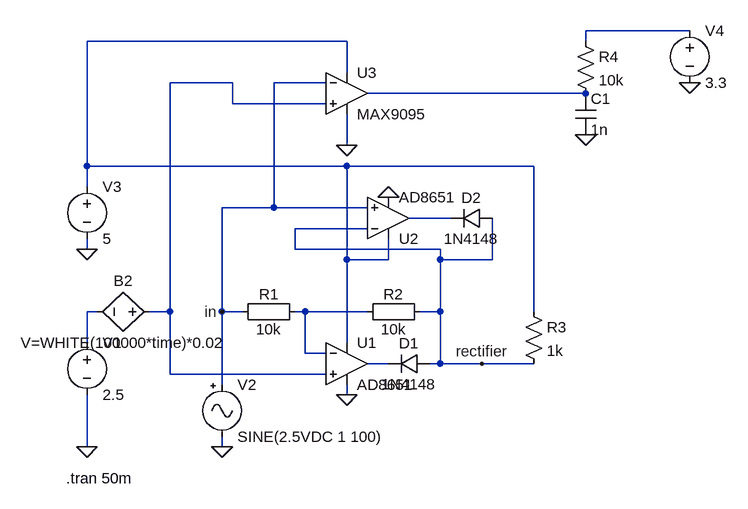
[diagram p0: schematic Precision rectifier 12V supply 2V5 to 5V to 0V to 5V.asc]
Precision rectifier 12V supply 2V5 to 5V to 0V to 5V.asc, the LTspice schematic file:
Version 4
SHEET 1 1444 680
WIRE 896 -320 736 -320
WIRE 368 -304 -32 -304
WIRE 736 -304 736 -320
WIRE 368 -256 368 -304
WIRE 192 -240 96 -240
WIRE 336 -240 256 -240
WIRE 736 -224 400 -224
WIRE 192 -208 192 -240
WIRE 336 -208 192 -208
WIRE 368 -144 368 -192
WIRE -32 -112 -32 -304
WIRE 368 -112 -32 -112
WIRE 656 -112 368 -112
WIRE -32 -80 -32 -112
WIRE 256 -48 256 -240
WIRE 256 -48 176 -48
WIRE 400 -48 256 -48
WIRE 528 -32 464 -32
WIRE 400 -16 288 -16
WIRE -32 16 -32 0
WIRE 288 16 288 -16
WIRE 512 16 288 16
WIRE 368 32 368 -112
WIRE 432 32 432 0
WIRE 432 32 368 32
WIRE 512 32 512 16
WIRE 592 32 592 -32
WIRE 592 32 512 32
WIRE -16 112 -32 112
WIRE 96 112 96 -240
WIRE 96 112 64 112
WIRE 176 112 176 -48
WIRE 208 112 176 112
WIRE 304 112 288 112
WIRE 400 112 304 112
WIRE 512 112 512 32
WIRE 512 112 480 112
WIRE 656 112 656 -112
WIRE -32 160 -32 112
WIRE 368 160 368 32
WIRE 304 176 304 112
WIRE 336 176 304 176
WIRE 432 192 400 192
WIRE 512 192 512 112
WIRE 512 192 496 192
WIRE 576 192 512 192
WIRE 656 192 576 192
WIRE 96 208 96 112
WIRE 336 208 96 208
WIRE 176 224 176 112
WIRE 368 240 368 224
WIRE -32 320 -32 240
WIRE 176 320 176 304
FLAG 368 240 0
FLAG -32 320 0
FLAG 176 320 0
FLAG 176 112 in
FLAG -32 16 0
FLAG 576 192 rectifier
FLAG 432 -64 0
FLAG 368 -144 0
FLAG 736 -160 0
FLAG 896 -240 0
SYMBOL Misc\\EuropeanResistor 304 96 R90
WINDOW 0 5 56 VBottom 2
WINDOW 3 27 56 VTop 2
SYMATTR InstName R1
SYMATTR Value 10k
SYMBOL Misc\\EuropeanResistor 496 96 R90
WINDOW 0 5 56 VBottom 2
WINDOW 3 27 56 VTop 2
SYMATTR InstName R2
SYMATTR Value 10k
SYMBOL diode 496 208 M270
WINDOW 0 32 32 VTop 2
WINDOW 3 0 32 VBottom 2
SYMATTR InstName D1
SYMATTR Value 1N4148
SYMBOL voltage -32 144 R0
WINDOW 123 0 0 Left 2
WINDOW 39 0 0 Left 2
SYMATTR InstName V1
SYMATTR Value 2.5
SYMBOL Misc\\signal 176 208 R0
WINDOW 123 0 0 Left 2
WINDOW 39 0 0 Left 2
SYMATTR InstName V2
SYMATTR Value SINE(2.5VDC 1 100)
SYMBOL voltage -32 -96 R0
WINDOW 123 0 0 Left 2
WINDOW 39 0 0 Left 2
SYMATTR InstName V3
SYMATTR Value 5
SYMBOL res 640 96 R0
SYMATTR InstName R3
SYMATTR Value 1k
SYMBOL diode 592 -16 M270
WINDOW 0 32 32 VTop 2
WINDOW 3 0 32 VBottom 2
SYMATTR InstName D2
SYMATTR Value 1N4148
SYMBOL OpAmps\\AD8651 368 128 R0
SYMATTR InstName U1
SYMBOL OpAmps\\AD8651 432 32 M180
SYMATTR InstName U2
SYMBOL bv 80 112 R90
WINDOW 0 -32 56 VBottom 2
WINDOW 3 32 56 VTop 2
SYMATTR InstName B2
SYMATTR Value V=WHITE(100000*time)*0.02
SYMBOL res 720 -320 R0
SYMATTR InstName R4
SYMATTR Value 10k
SYMBOL Comparators\\MAX9095 368 -224 R0
SYMATTR InstName U3
SYMBOL cap 720 -224 R0
SYMATTR InstName C1
SYMATTR Value 1n
SYMBOL voltage 896 -336 R0
WINDOW 123 0 0 Left 0
WINDOW 39 0 0 Left 0
SYMATTR InstName V4
SYMATTR Value 3.3
TEXT -64 368 Left 2 !.tran 50m

The netlist it stands for:
* Precision rectifier 12V supply 2V5 to 5V to 0V to 5V.asc
R1 N007 in 10k
R2 rectifier N007 10k
D1 rectifier N008 1N4148
V1 N006 0 2.5
V2 in 0 SINE(2.5VDC 1 100)
V3 N002 0 5
R3 N002 rectifier 1k
D2 rectifier N005 1N4148
XU1 N003 N007 N002 0 N008 AD8651  ; pins In+ In- V+ V- OUT
XU2 in rectifier N002 0 N005 AD8651  ; pins In+ In- V+ V- OUT
B2 N003 N006 V=WHITE(100000*time)*0.02
R4 N001 N004 10k
* U3: MAX9095 (symbol Comparators\MAX9095 not available, pins judged from their places): In+=N003 In-=in V+=N002 V-=0 OUT=N004
C1 N004 0 1n
V4 N001 0 3.3
.model D D
.lib standard.dio
.tran 50m
.backanno
.end